# Altium schematic sheet MSP IOboard Power Schematic.SchDoc
size A4
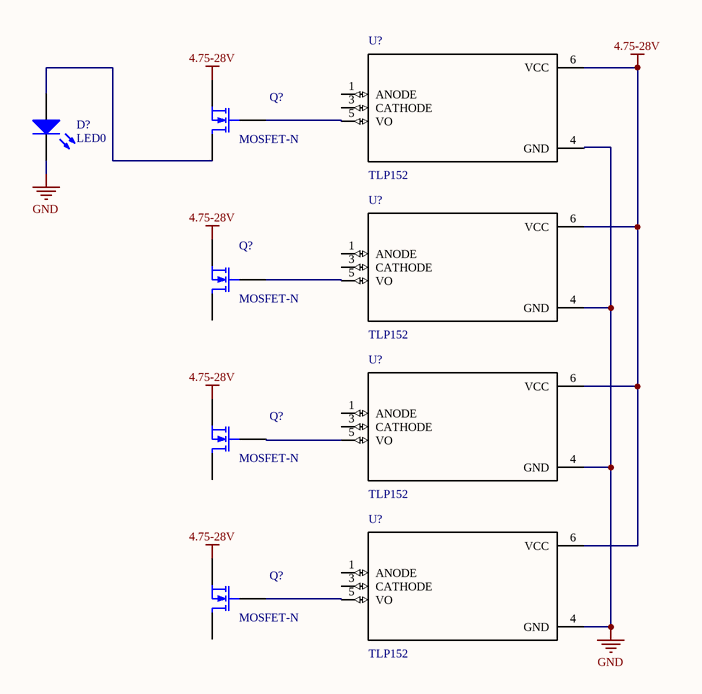
[diagram p0: MSP IOboard Power Schematic.SchDoc]

## Parts
(Parts that share a designator on the sheet are numbered #1, #2 ... from top to bottom, then left to right.)
D?  LED0  [LED-0]
Q?#1  MOSFET-N  [E3]
Q?#2  MOSFET-N  [E3]
Q?#3  MOSFET-N  [E3]
Q?#4  MOSFET-N  [E3]
U?#1  TLP152  [SOIC127P375X700X220-5N]
U?#2  TLP152  [SOIC127P375X700X220-5N]
U?#3  TLP152  [SOIC127P375X700X220-5N]
U?#4  TLP152  [SOIC127P375X700X220-5N]

## Nets
4.75-28V: Q?#1.3(S) Q?#2.3(S) Q?#3.3(S) Q?#4.3(S) U?#1.6(VCC) U?#2.6(VCC) U?#3.6(VCC) U?#4.6(VCC)
GND: D?.2(K) U?#1.4(GND) U?#2.4(GND) U?#3.4(GND) U?#4.4(GND)
NetD?_1: D?.1(A) Q?#1.1(D)
NetQ?#1_2: Q?#1.2(G) U?#1.5(VO)
NetQ?#2_2: Q?#2.2(G) U?#2.5(VO)
NetQ?#3_2: Q?#3.2(G) U?#3.5(VO)
NetQ?#4_2: Q?#4.2(G) U?#4.5(VO)

Not connected (* = marked no-connect by the designer): Q?#2 1(D); Q?#3 1(D); Q?#4 1(D); U?#1 1(ANODE) 3(CATHODE); U?#2 1(ANODE) 3(CATHODE); U?#3 1(ANODE) 3(CATHODE); U?#4 1(ANODE) 3(CATHODE)

## Library data of the parts
D? = LED0: Typical INFRARED GaAs LED; Published: 8-Jun-2000; LatestRevisionDate: 08-Jul-2005; LatestRevisionNote: Mech Layer 1 removed.; PackageReference: LED-0; Publisher: Altium Limited; PackageDescription: LED; 2 Leads
Q?#1-Q?#4 = MOSFET-N: N-Channel MOSFET; Published: 8-Jun-2000; LatestRevisionDate: 17-Jul-2002; LatestRevisionNote: Re-released for DXP Platform.; PackageVersion: 1995/1996; PackageReference: E3; Publisher: Altium Limited; PackageDescription: TO, Flat Index; 3 In-Line, Axial Leads; Body Dia. 4.6mm; Lead Dia. 0.5 mm (max)
U?#1-U?#4 = TLP152: Optocoupler, Gate Driver, 3.75kv, Smdip; MF: Toshiba; MP: TLP152; SnapEDA_Link: https://www.snapeda.com/parts/TLP152/Toshiba/view-part/?ref=snap; Availability: Unavailable; Package: SOIC-5 Toshiba; Price: None; Value: *